# EasyEDA Pro project sincon_badge.eprj, schematic Yuzuki2040 RP2040 开发板
Board Name: Yuzuki2040 RP2040 开发板; Create Date: 2025-09-25; Page Name: Yuzuki2040; Project Name: sincon_badge; Schematic Name: Yuzuki2040 RP2040 开发板; Update Date: 2025-09-25; Add into BOM: yes; Company: YuzukiTsuru; Convert to PCB: yes; Date: 2021-07-07; Draw By: GloomyGhost; REV: 1.1; Sheet: 1/1; spicePre: .
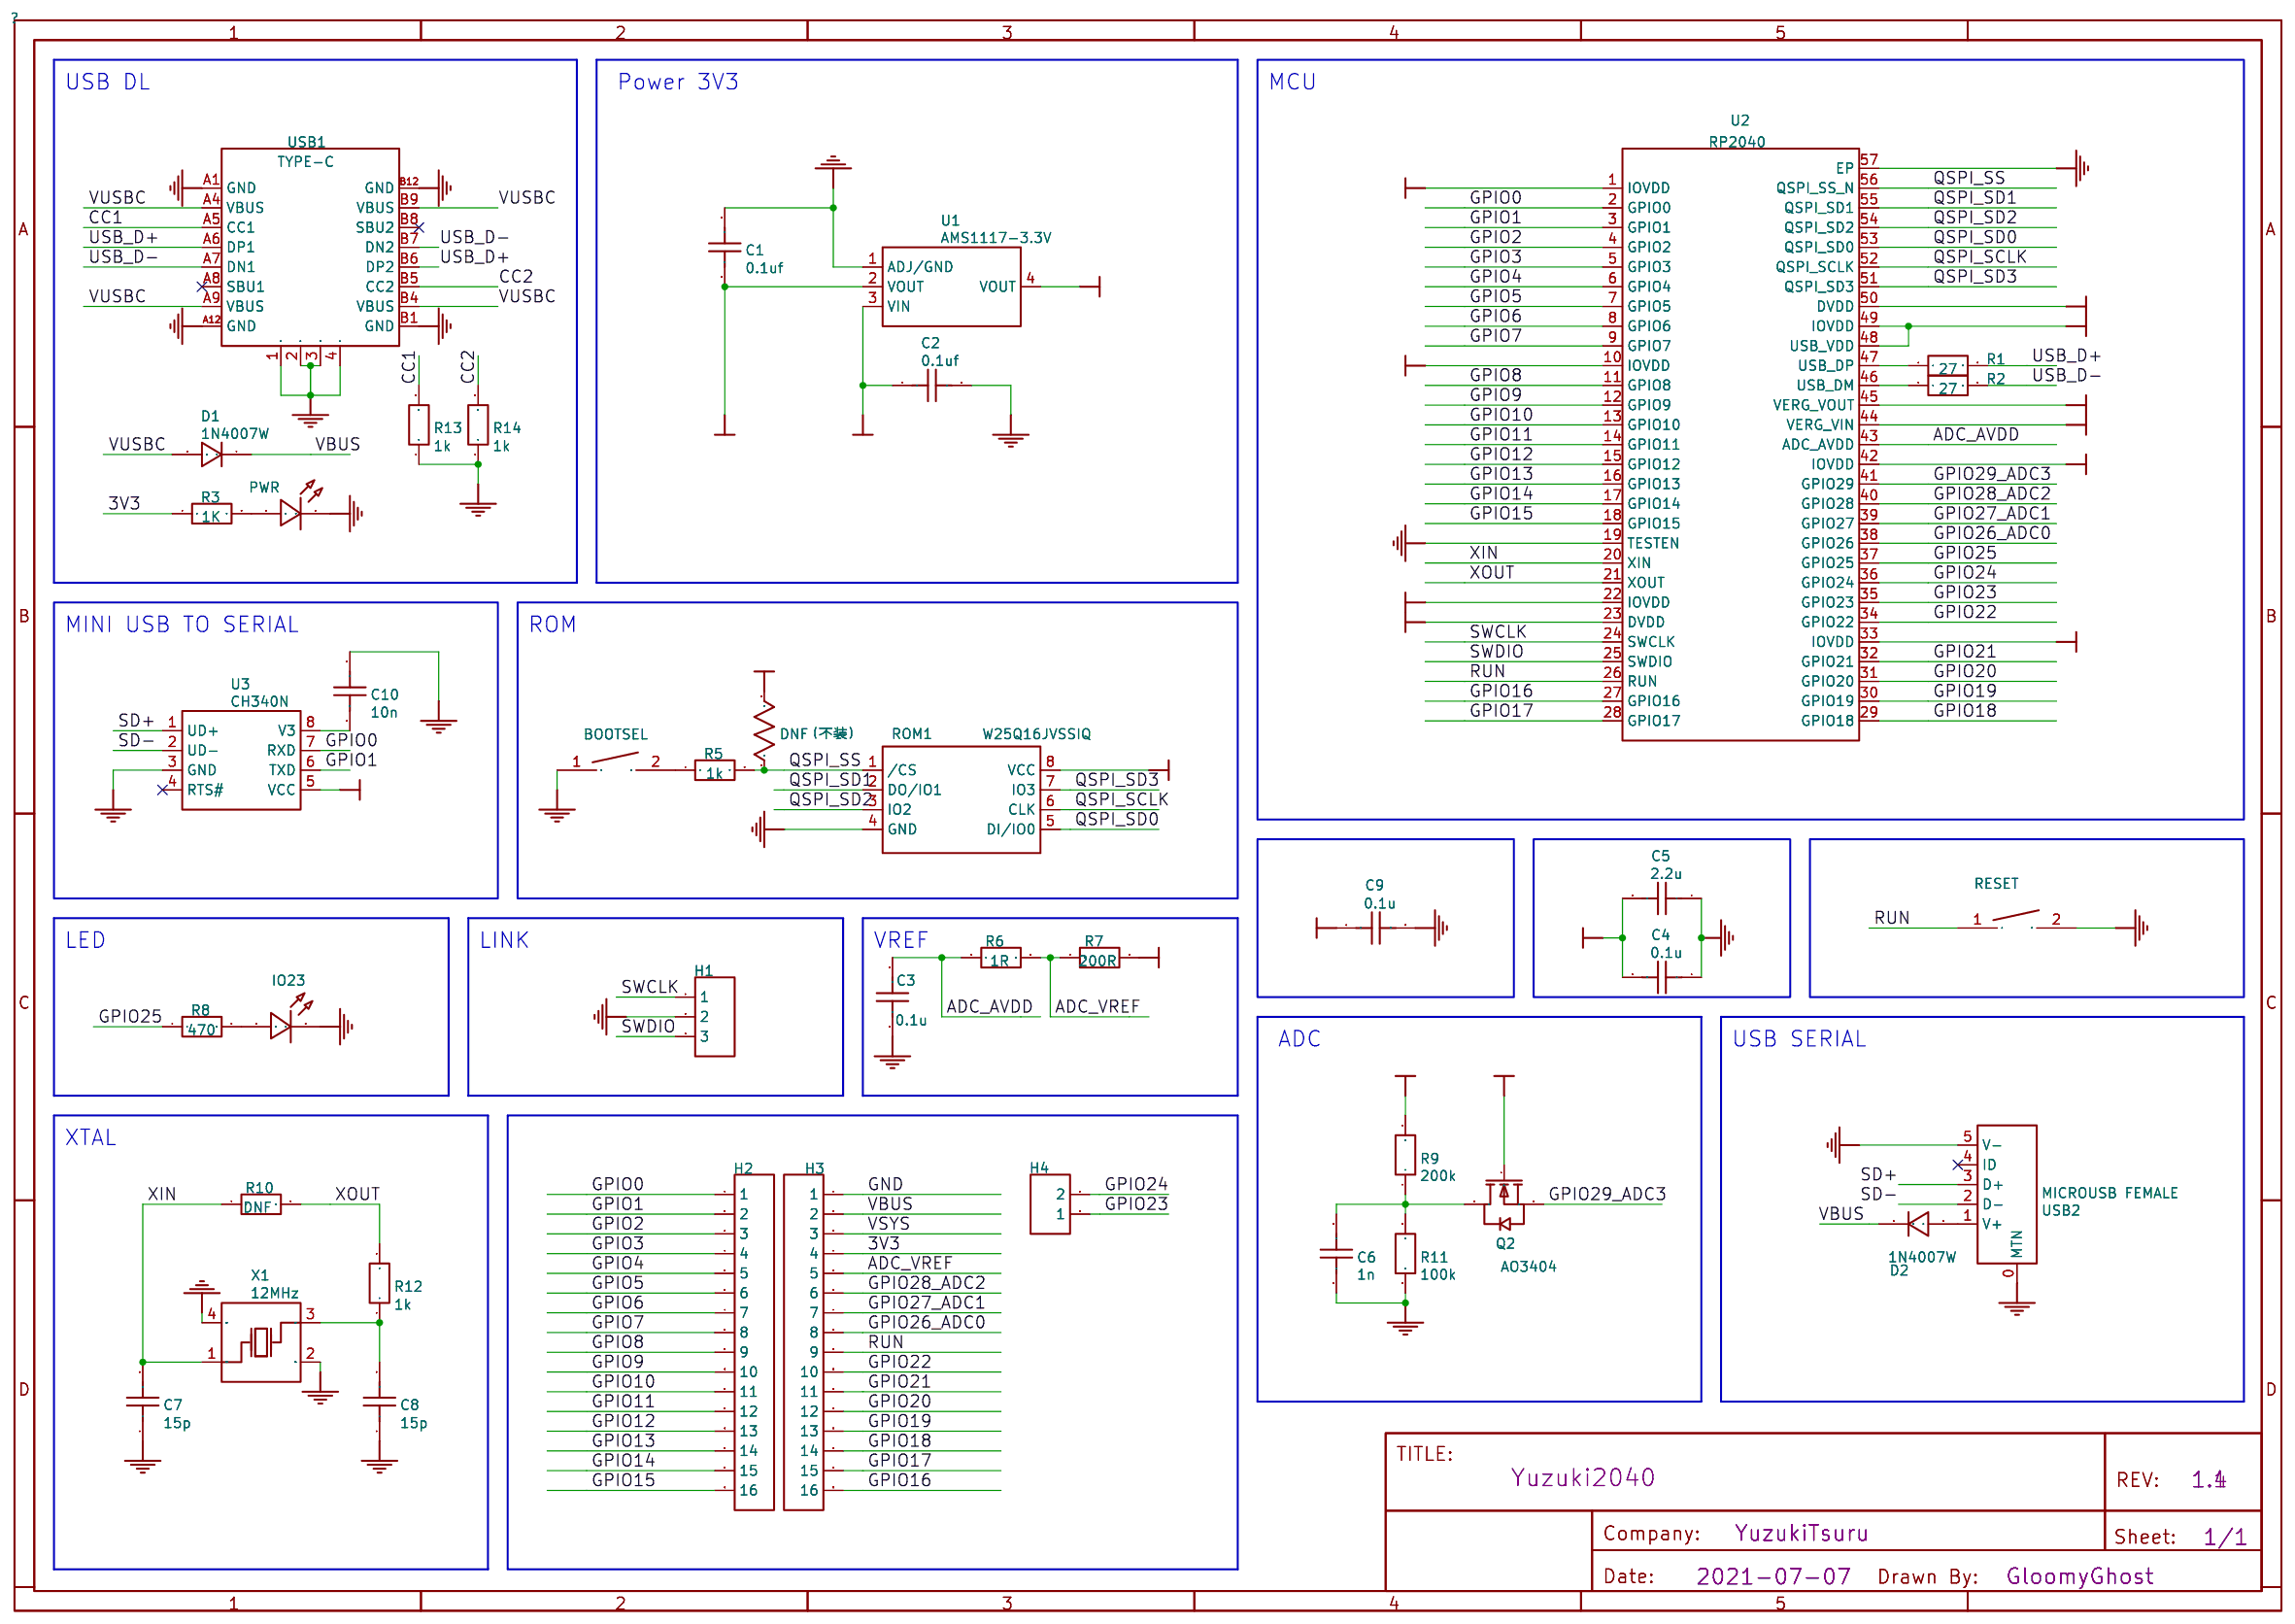
[diagram p1: schematic sheet]

## Parts
BOOTSEL  TSA343G00-250J2  [SW-SMD_L4.0-W2.9-LS5.0]
C1  0.1uf  [C0603 NSK]
C2  0.1uf  [C0603 NSK]
C3  0.1u  [C0603 NSK]
C4  0.1u  [C0603 NSK]
C5  2.2u  [C0603 NSK]
C6  1n  [C0603 NSK]
C7  15p  [C0603 NSK]
C8  15p  [C0603 NSK]
C9  0.1u  [C0603 NSK]
C10  10n  [C0603 NSK]
D1  1N4007W  [SOD-123 NSK]
D2  1N4007W  [SOD-123 NSK]
H1  HDR-F-2.54_1x3  [HDR-F-2.54_1X3]
H2  HDR-F-2.54_1x16  [HDR-F-2.54_1X16]
H3  HDR-F-2.54_1x16  [HDR-F-2.54_1X16]
H4  HDR-F-2.54_1x2  [HDR-F-2.54_1X2]
IO23  LED-0603_G  [LED0603_GREEN]
PWR  LED-0603_G  [LED0603_GREEN]
Q2  AO3404  [SOT-23-3_L2.9-W1.3-P1.90-LS2.4-BR]
R1  27  [R0603 NSK]
R2  27  [R0603 NSK]
R3  1K  [R0603 NSK]
R4  DNF（不装）  [R0603 NSK]
R5  1k  [R0603 NSK]
R6  1R  [R0603 NSK]
R7  200R  [R0603 NSK]
R8  470  [R0603 NSK]
R9  200k  [R0603 NSK]
R10  DNF  [R0603 NSK]
R11  100k  [R0603 NSK]
R12  1k  [R0603 NSK]
R13  1k  [R0603 NSK]
R14  1k  [R0603 NSK]
RESET  TSA343G00-250J2  [SW-SMD_L4.0-W2.9-LS5.0]
ROM1  W25Q16JVSSIQ  [SOIC-8_L5.3-W5.3-P1.27-LS8.0-BL]
U1  AMS1117-3.3V  [SOT-223-4_L6.5-W3.5-P2.30-LS7.0-BR]
U2  RP2040  [QFN-56_L7.0-W7.0-P0.90-TL-EP3.2]
U3  CH340N  [SOP-8_L5.0-W4.0-P1.27-LS6.0-BL]
USB1  TYPE-C  [USB-C-SMD_TYC-302-16]
USB2  MICROUSB FEMALE  [MICRO-USB-SMD_5P-P0.65-H-F_C10418]
X1  12MHz  [OSC-SMD_4P-L3.2-W2.5-BL-1]

## Library data of the parts
BOOTSEL RESET = TSA343G00-250J2: Supplier: LCSC; Supplier Part: C354946; Manufacturer: BRIGHT; JLCPCB Part Class: Extended Part; Contributor: LCSC; spicePre: S
C1 C2 = AC0603KRX7R9BB472: Supplier: LCSC; Supplier Part: C149615; Manufacturer: YAGEO; nameAlias: Capacitance; Contributor: LCSC; spicePre: C
C3 C4 C9 = 0.1u: nameAlias: Value(F); Contributor: LCEDA_Lib; spicePre: C; spiceSymbolName: C_0603_US
C5 = 2.2u: nameAlias: Value(F); Contributor: LCEDA_Lib; spicePre: C; spiceSymbolName: C_0603_US
C6 = 1n: nameAlias: Value(F); Contributor: LCEDA_Lib; spicePre: C; spiceSymbolName: C_0603_US
C7 = 15p: nameAlias: Value(F); Contributor: LCEDA_Lib; spicePre: C; spiceSymbolName: C_0603_US
C8 = 15p: nameAlias: Value(F); Contributor: LCEDA_Lib; spicePre: C; spiceSymbolName: C_0603_US; Package Display: No
C10 = 10n: nameAlias: Value(F); Contributor: LCEDA_Lib; spicePre: C; spiceSymbolName: C_0603_US
D1 D2 = 1N4007W: Supplier: LCSC; Supplier Part: C328592; Manufacturer: BLUE ROCKET; Contributor: LCEDA_Lib; spicePre: D
H1 = HDR-F-2.54_1x3: Supplier Part: C146690; Supplier: LCSC; Contributor: LCEDA_Lib; spicePre: H
H2 H3 = HDR-F-2.54_1x16: Supplier Part: C66987; Supplier: LCSC; Contributor: LCEDA_Lib; spicePre: H
H4 = HDR-F-2.54_1x2: Supplier Part: C49661; Supplier: LCSC; Contributor: LCEDA_Lib; spicePre: H
IO23 PWR = 19-217/GHC-YR1S2/3T: Manufacturer: EVERLIGHT(台湾亿光); Supplier Part: C72043; Supplier: LCSC; Contributor: LCEDA_Lib; spicePre: L
Q2 = AO3404: Supplier: LCSC; Supplier Part: C192925; Manufacturer: Guangdong Hottech; JLCPCB Part Class: Extended Part; Contributor: LCSC; spicePre: Q
R1 R2 = 27: nameAlias: Value(Ω); Contributor: LCEDA_Lib; spicePre: R; spiceSymbolName: R_0603_EU
R3 R5 R12-R14 = 1k: nameAlias: Value(Ω); Contributor: LCEDA_Lib; spicePre: R; spiceSymbolName: R_0603_EU
R4 = DNF（不装）: nameAlias: Value(Ω); Contributor: LCEDA_Lib; spicePre: R; spiceSymbolName: R_0603_US
R6 = 1R: nameAlias: Value(Ω); Contributor: LCEDA_Lib; spicePre: R; spiceSymbolName: R_0603_EU
R7 = 200R: nameAlias: Value(Ω); Contributor: LCEDA_Lib; spicePre: R; spiceSymbolName: R_0603_EU
R8 = 470: nameAlias: Value(Ω); Contributor: LCEDA_Lib; spicePre: R; spiceSymbolName: R_0603_EU
R9 = 200k: nameAlias: Value(Ω); Contributor: LCEDA_Lib; spicePre: R; spiceSymbolName: R_0603_EU
R10 = DNF: nameAlias: Value(Ω); Contributor: LCEDA_Lib; spicePre: R; spiceSymbolName: R_0603_EU
R11 = 100k: nameAlias: Value(Ω); Contributor: LCEDA_Lib; spicePre: R; spiceSymbolName: R_0603_EU
ROM1 = W25Q16JVSSIQ: Supplier: LCSC; Manufacturer: WINBOND; Supplier Part: C82317; JLCPCB Part Class: Extended Part; spicePre: U
U1 = AMS1117-3.3V: Supplier: LCSC; Supplier Part: C2688239; Manufacturer: WPMtek(维攀微); JLCPCB Part Class: Extended Part; Contributor: LCSC; spicePre: U
U2 = MC34VR500V4ES: Supplier: RS-Online; Manufacturer: Raspberry Silicon; link: https://datasheets.raspberrypi.org/rp2040/rp2040-datasheet.pdf; Contributor: rqnce; spicePre: U
U3 = CH340N: Supplier: LCSC; Supplier Part: C506813; Manufacturer: WCH(Jiangsu Qin Heng); JLCPCB Part Class: Extended Part; Contributor: LCSC; spicePre: U
USB1 = TYC-302-16: Supplier: LCSC; Supplier Part: C381477; Manufacturer: XUNPU; Contributor: LCSC; spicePre: U; Package Display: No
USB2 = micro USBFemale: Supplier: LCSC; Manufacturer: ValuePro; Supplier Part: C10418; JLCPCB Part Class: Extended Part; spicePre: U
X1 = X322512MLB4SI: Supplier: LCSC; Manufacturer: YXC; Supplier Part: C112971; JLCPCB Part Class: Extended Part; nameAlias: Frequency; spicePre: X

## Nets
1V1: C9.1 U2.23(DVDD) U2.45(VERG_VOUT) U2.50(DVDD)
3V3: C1.1 C4.2 C5.2 H3.4 Q2.1(G) R3.1 R4.2 R7.2 ROM1.8(VCC) U1.2(VOUT) U1.4(VOUT) U2.1(IOVDD) U2.10(IOVDD) U2.22(IOVDD) U2.33(IOVDD) U2.42(IOVDD) U2.44(VERG_VIN) U2.48(USB_VDD) U2.49(IOVDD)
GND: BOOTSEL.1 C1.2 C2.2 C3.1 C4.1 C5.1 C6.1 C7.1 C8.1 C9.2 C10.2 H1.2 H3.1 IO23.2 PWR.2 R11.1 R13.1 R14.1 RESET.2 ROM1.4(GND) U1.1(ADJ/GND) U2.19(TESTEN) U2.57(EP) U3.3(GND) USB1.1 USB1.2 USB1.3 USB1.4 USB1.A1(GND) USB1.A12(GND) USB1.B1(GND) USB1.B12(GND) USB2.0(MTN) USB2.5(V-) X1.2(GND) X1.4(GND)
VBUS: C2.1 D1.1 D2.1 H3.2 U1.3(VIN) U3.5(VCC)
ADC_AVDD: C3.2 R6.1 U2.43(ADC_AVDD)
ADC_VREF: H3.5 R6.2 R7.1
CC1: R13.2 USB1.A5(CC1)
CC2: R14.2 USB1.B5(CC2)
GPIO0: H2.1 U2.2(GPIO0) U3.7(RXD)
GPIO1: H2.2 U2.3(GPIO1) U3.6(TXD)
GPIO2: H2.3 U2.4(GPIO2)
GPIO3: H2.4 U2.5(GPIO3)
GPIO4: H2.5 U2.6(GPIO4)
GPIO5: H2.6 U2.7(GPIO5)
GPIO6: H2.7 U2.8(GPIO6)
GPIO7: H2.8 U2.9(GPIO7)
GPIO8: H2.9 U2.11(GPIO8)
GPIO9: H2.10 U2.12(GPIO9)
GPIO10: H2.11 U2.13(GPIO10)
GPIO11: H2.12 U2.14(GPIO11)
GPIO12: H2.13 U2.15(GPIO12)
GPIO13: H2.14 U2.16(GPIO13)
GPIO14: H2.15 U2.17(GPIO14)
GPIO15: H2.16 U2.18(GPIO15)
GPIO16: H3.16 U2.27(GPIO16)
GPIO17: H3.15 U2.28(GPIO17)
GPIO18: H3.14 U2.29(GPIO18)
GPIO19: H3.13 U2.30(GPIO19)
GPIO20: H3.12 U2.31(GPIO20)
GPIO21: H3.11 U2.32(GPIO21)
GPIO22: H3.10 U2.34(GPIO22)
GPIO23: H4.1 U2.35(GPIO23)
GPIO24: H4.2 U2.36(GPIO24)
GPIO25: R8.1 U2.37(GPIO25)
GPIO26_ADC0: H3.8 U2.38(GPIO26)
GPIO27_ADC1: H3.7 U2.39(GPIO27)
GPIO28_ADC2: H3.6 U2.40(GPIO28)
GPIO29_ADC3: Q2.2(S) U2.41(GPIO29)
QSPI_SCLK: ROM1.6(CLK) U2.52(QSPI_SCLK)
QSPI_SD0: ROM1.5(DI/IO0) U2.53(QSPI_SD0)
QSPI_SD1: ROM1.2(DO/IO1) U2.55(QSPI_SD1)
QSPI_SD2: ROM1.3(IO2) U2.54(QSPI_SD2)
QSPI_SD3: ROM1.7(IO3) U2.51(QSPI_SD3)
QSPI_SS: R4.1 R5.2 ROM1.1(/CS) U2.56(QSPI_SS_N)
RUN: H3.9 RESET.1 U2.26(RUN)
SD+: U3.1(UD+) USB2.3(D+)
SD-: U3.2(UD-) USB2.2(D-)
SWCLK: H1.1 U2.24(SWCLK)
SWDIO: H1.3 U2.25(SWDIO)
USB_D+: R1.2 USB1.A6(DP1) USB1.B6(DP2)
USB_D-: R2.2 USB1.A7(DN1) USB1.B7(DN2)
VSYS: H3.3 R9.2
VUSBC: D1.2 USB1.A4(VBUS) USB1.A9(VBUS) USB1.B4(VBUS) USB1.B9(VBUS)
XIN: C7.2 R10.1 U2.20(XIN) X1.1(OSC1)
XOUT: R10.2 R12.2 U2.21(XOUT)
BOOTSEL_2: BOOTSEL.2 R5.1
Net-(D2-2): D2.2 USB2.1(V+)
PWR_1: PWR.1 R3.2
Q2_3: C6.2 Q2.3(D) R9.1 R11.2
R8_2: IO23.1 R8.2
U2_46: R2.1 U2.46(USB_DM)
U2_47: R1.1 U2.47(USB_DP)
U3_8: C10.1 U3.8(V3)
X1_3: C8.2 R12.1 X1.3(OSC2)

Not connected (* = marked no-connect by the designer): U3 4(RTS#)*; USB1 A8(SBU1)* B8(SBU2)*; USB2 4(ID)*

## Notes on the sheet
- USB DL
- Power 3V3
- MCU
- MINI USB TO SERIAL
- ROM
- LED
- LINK
- VREF
- ADC
- USB SERIAL
- XTAL
